# EAGLE design batt_protector (EAGLE 9.5.1)
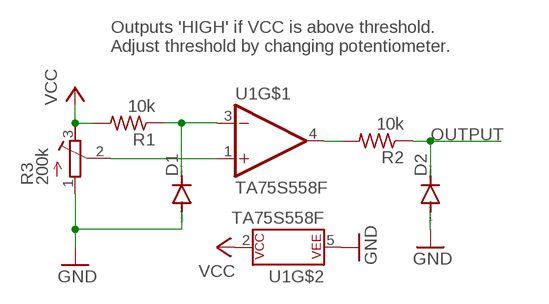
[diagram p0: schematic, sheet 1]

## Parts
D1  DIODE-SOD323-R  [SOD323-R]
D2  DIODE-SOD323-R  [SOD323-R]
R1  10k  R-US_R0603  [R0603]
R2  10k  R-US_R0603  [R0603]
R3  200k  R-TRIMM64P  [RTRIM64P]
U1  TA75S558F  [SOTFL95P275X130-5N]

## Nets
GND: D1.A D2.A R3.1(A) U1.5(P$V-)
INPUT: R3.2(S) U1.1(+IN)
N$2: R2.2 U1.4(OUT)
OUTPUT: D2.C R2.1
REFV: D1.C R1.1 U1.3(-IN)
VCC: R1.2 R3.3(E) U1.2(P$V+)

## Notes on the sheet
- Outputs 'HIGH' if VCC is above threshold.
  Adjust threshold by changing potentiometer.

## Library data of the parts
D1 D2 = diode:DIODE-: DIODE
R1 R2 = rcl:R-US_: RESISTOR, American symbol; SPICEPREFIX: R
R3 = rcl:R-TRIMM: Trimm resistor; SPICEMODEL: X; SPICEPREFIXL: POT
U1 = TA75S558F:TA75S558F

## Board
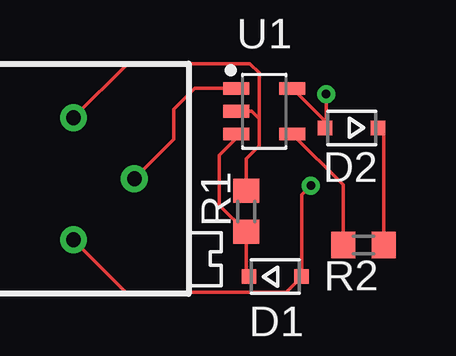
[diagram p1: board, top side]
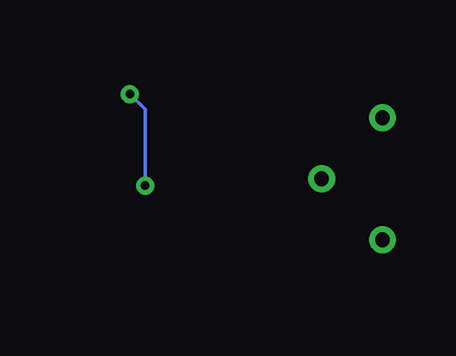
[diagram p2: board, bottom side, seen from below]

No outline drawn. Coordinates in mm, seen from the top.
Copper layers (1*16): Top 0.035mm / dielectric 1.5mm / Bottom 0.035mm
Design rules "default": minimum track width 6mil, minimum drill 0.35mm, track to track 6mil, track to pad 6mil, pad to pad 6mil, via to via 6mil, smd to smd 6mil, copper to edge 40mil, drill to drill 6mil, minimum pad ring 10mil, minimum via ring 8mil, stop-mask expansion 4mil, vias tented up to drill 0mil, thermal gap 10mil

### Footprints (pad centres in the part's own frame; a part is rotated, then mirrored left to right if it is on the bottom)
SOD323-R = smd 0.6 x 0.6: A 1.1,0; C -1.1,0
R0603 = smd 1 x 1.1: 1 -0.85,0; 2 0.85,0
RTRIM64P = drill 0.61: 1 0,-2.54; 2 2.54,0; 3 0,2.54
SOTFL95P275X130-5N = smd 1.074 x 0.529: 1 -1.169,0.95; 2 -1.169,0; 3 -1.169,-0.95; 4 1.169,-0.95; 5 1.169,0.95

### Placement (x,y rotation side)
D1  8.68,-3.79 0 top
D2  11.86,2.4 180 top
R1  7.46,-1.07 90 top
R2  12.36,-2.48 180 top
R3  0.27,0.28 0 top
U1  8.21,3.1 0 top

### Tracks (layer width: path | path; a pad name or v marks a point on that pad's centre or on a via)
GND  (via drill 0.35)
  Top 0.152: R3.1 2.46,-4.45 9.12,-4.45 D1.A 9.78,-0.39 v10.16,0 | U1.5 10.76,2.67 D2.A 10.79,2.44 v10.79,3.81
  Bottom 0.152: v10.16,0 10.16,3.17 v10.79,3.81
INPUT
  Top 0.152: R3.2 4.45,1.93 4.45,3.17 5.32,4.04 U1.1
N$2
  Top 0.152: U1.4 11.51,0.02 R2.2
OUTPUT
  Top 0.152: D2.C 13.21,2.15 R2.1
REFV
  Top 0.152: D1.C 7.46,-3.69 R1.1 6.35,-0.81 6.35,1.27 7.05,1.97 U1.3
VCC
  Top 0.152: R1.2 7.46,1.11 8,1.65 8,2.79 | 8,2.79 7.7,3.1 U1.2 | R3.3 2.52,5.08 7.62,5.08 8,4.7 8,2.79